# Altium schematic sheet Motor_Controller.SchDoc
size A; SheetNumber: 2; SheetTotal: 3
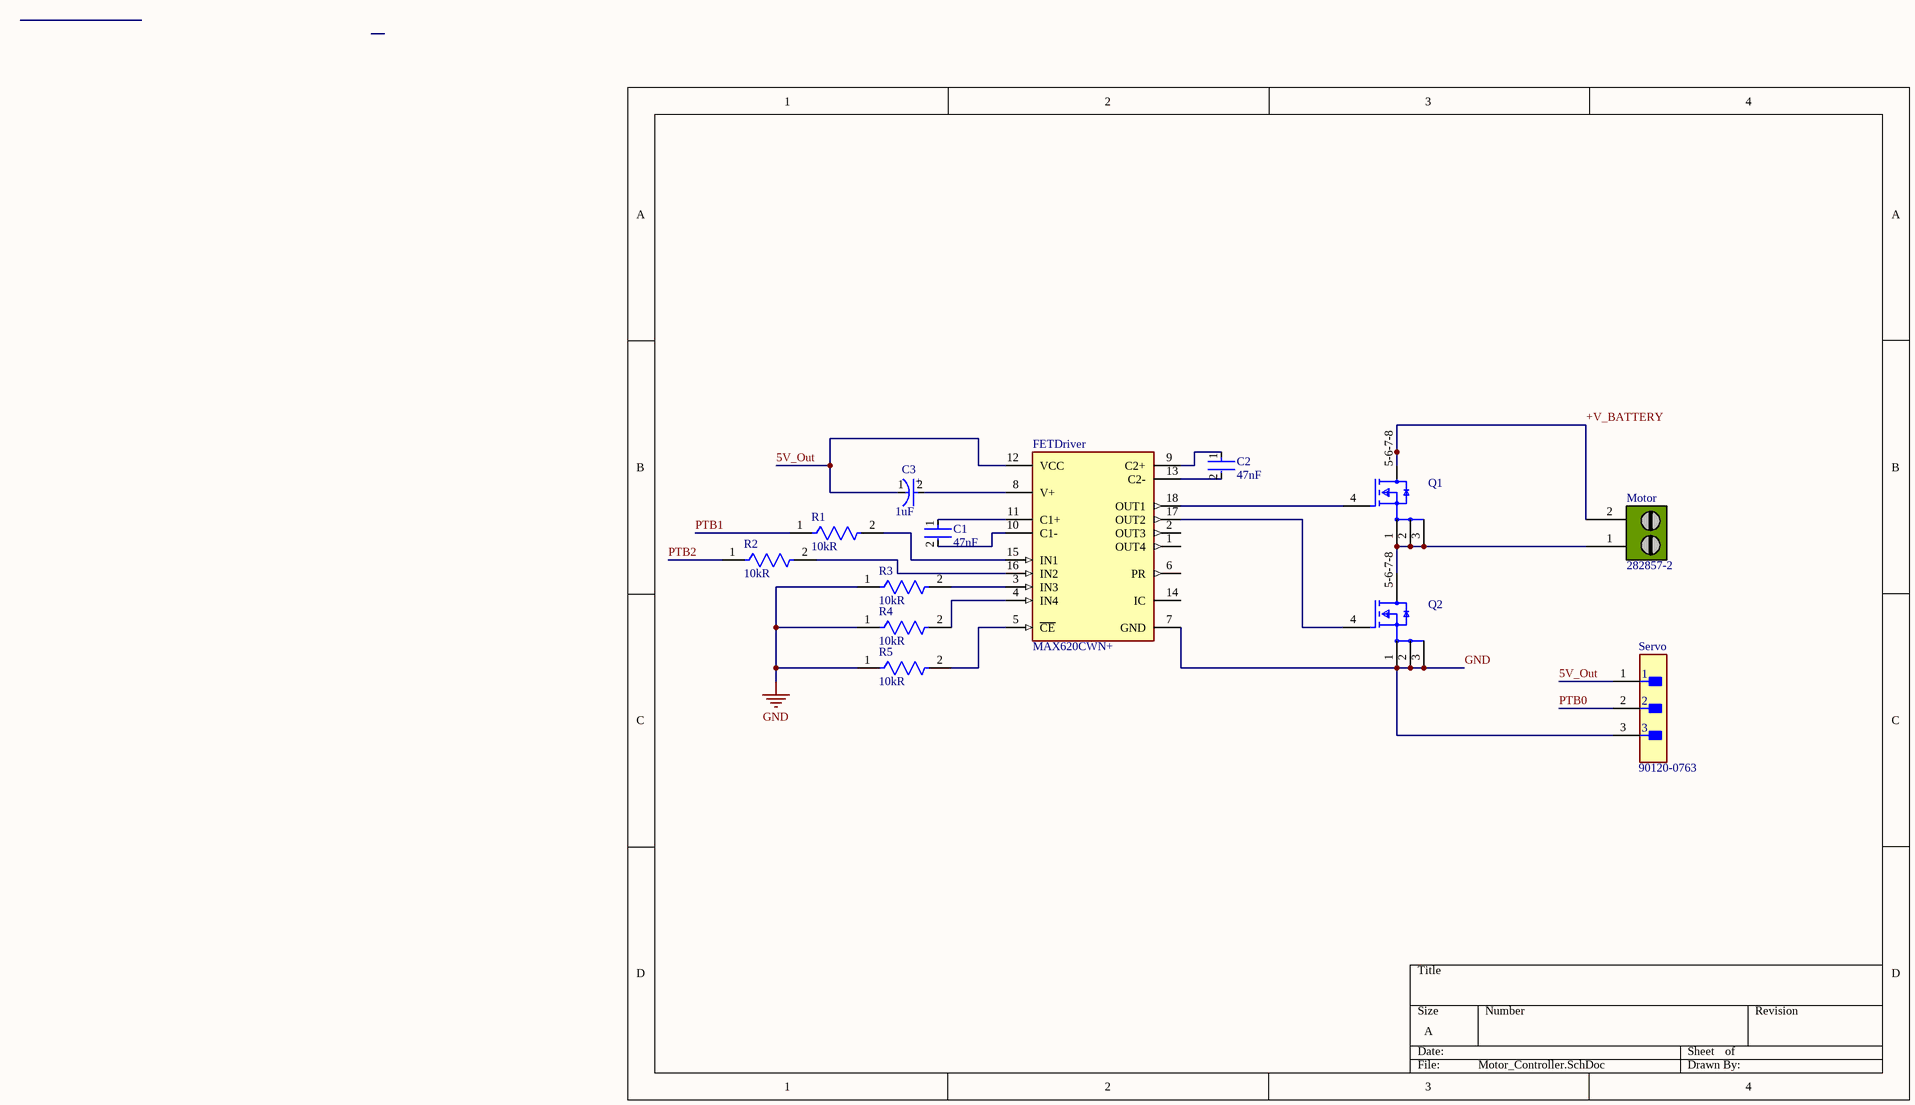
[diagram p0: Motor_Controller.SchDoc]

## Parts
C1  Capacitance: 47nF  [FP-0805-L_2_01_0_2-W_1_25-IPC_B]  (hidden comment: 08055C473JAT2A)
C2  Capacitance: 47nF  [FP-0805-L_2_01_0_2-W_1_25-IPC_B]  (hidden comment: 08055C473JAT2A)
C3  Capacitance: 1uF  [FP-T491A105K025AT-MFG]  (hidden comment: T491A105K025AT)
FETDriver  MAX620CWN+  [FP-W18-1-MFG]
Motor  282857-2  [282857-2]
Q1  CSD17306Q5A  [FP-DQJ0008A-MFG]  (value not drawn)
Q2  CSD17306Q5A  [FP-DQJ0008A-MFG]  (value not drawn)
R1  Resistance: 10kR  [FP-CR0805-IPC_B]  (hidden comment: CR0805-JW-103ELF)
R2  Resistance: 10kR  [FP-CR0805-IPC_B]  (hidden comment: CR0805-JW-103ELF)
R3  Resistance: 10kR  [FP-CR0805-IPC_B]  (hidden comment: CR0805-JW-103ELF)
R4  Resistance: 10kR  [FP-CR0805-IPC_B]  (hidden comment: CR0805-JW-103ELF)
R5  Resistance: 10kR  [FP-CR0805-IPC_B]  (hidden comment: CR0805-JW-103ELF)
Servo  90120-0763  [FP-90120-0763-MFG]

## Nets
GND: FETDriver.7(GND) Q2.1(S) Q2.2(S) Q2.3(S) R3.1 R4.1 R5.1 Servo.3
5V_Out: C3.1(C) FETDriver.12(VCC) Servo.1
+V_BATTERY: Motor.2 Q1.5-6-7-8(D)
PTB0: Servo.2
PTB1: R1.1
PTB2: R2.1
NetC1_1: C1.1 FETDriver.11(C1+)
NetC1_2: C1.2 FETDriver.10(C1-)
NetC2_1: C2.1 FETDriver.9(C2+)
NetC2_2: C2.2 FETDriver.13(C2-)
NetC3_2: C3.2(A) FETDriver.8(V+)
NetFETDriver_3: FETDriver.3(IN3) R3.2
NetFETDriver_4: FETDriver.4(IN4) R4.2
NetFETDriver_5: FETDriver.5(~{CE}) R5.2
NetFETDriver_15: FETDriver.15(IN1) R1.2
NetFETDriver_16: FETDriver.16(IN2) R2.2
NetFETDriver_17: FETDriver.17(OUT2) Q2.4(G)
NetFETDriver_18: FETDriver.18(OUT1) Q1.4(G)
NetMotor_1: Motor.1 Q1.1(S) Q1.2(S) Q1.3(S) Q2.5-6-7-8(D)

Not connected (* = marked no-connect by the designer): FETDriver 1(OUT4) 2(OUT3) 6(PR) 14(IC)

## Notes on the sheet
- (in symbol CMP-03017-000047-1) +

## Library data of the parts
C1 C2 = CMP-2007-04425-2: General Purpose Ceramic Capacitor, 0805, 47nF, 5%, X7R, 0.15, 50V; Dissipation Factor: 2.5%; Tolerance: 10%; Voltage: 50V; Voltage Rating (DC): 50V; Case Code (Imperial): 0805; Termination: SMD/SMT; Lead Free: Lead Free; Construction: Flat; Case Code (Metric): 2012; Series: -; Height: 0.94mm; Length: 2.01mm; Dielectric: X7R; Min Operating Temperature: -55°C; Voltage Rating: 50V; Max Operating Temperature: 125°C; Width: 0.049inch; Dielectric Material: Ceramic; Thickness: 0.037inch; Mount: Surface Mount; Radiation Hardening: No; REACH SVHC: No SVHC; Number of Pins: 2; Case/Package: 0805; Packaging: Tape and Reel; RoHS Compliant: Yes; Contact Plating: Tin; Depth: 1.25mm; Package Quantity: 1
C3 = CMP-03017-000047-1: CAP TANT 1UF 10% 25V 1206; Polarity: Polar; Leakage Current: 500nA; ESR (Equivalent Series Resistance): 8R; Tolerance: 20%; Dielectric Material: Tantalum; Life (Hours): 2000Hour; Dissipation Factor: 4%; Case/Package: 1206; RoHS Compliant: Yes; Voltage Rating: 25V; Voltage Rating (DC): 25V; Max Operating Temperature: 125°C; REACH SVHC: No SVHC; Lead Pitch: 1.2mm; Height - Seated (Max): 0.071inch; Packaging: Tape and Reel; Lead Free: Lead Free; Radiation Hardening: No; Width: 1.6mm; Depth: 1.6mm; Number of Pins: 2; Termination: SMD/SMT; Case Code (Metric): 3216; Features: General Purpose; Voltage: 25V; Min Operating Temperature: -55°C; Package Quantity: 1; Mount: Surface Mount; Length: 3.2mm; Height: 1.6mm; Case Code (Imperial): 1206
FETDriver = CMP-05716-000008-1: IC GATE DRVR HIGH-SIDE 18SOIC; Nominal Supply Current: 500uA; Max Power Dissipation: 762mW; Fall Time: 2500ns; Max Output Current: 25mA; Rise Time: 1700ns; Min Supply Voltage: 4.5V; Max Supply Voltage: 16.5V; Number of Outputs: 4; Max Operating Temperature: 70°C; Packaging: Rail/Tube; Mount: Surface Mount; Lead Free: Lead Free; Min Operating Temperature: 0°C; Package Quantity: 40; Radiation Hardening: No; Number of Pins: 18; Max Supply Current: 500uA; Case/Package: SOIC; Supply Current: 500uA; RoHS Compliant: Yes; Number of Drivers: 4; Series: -
Motor = 282857-2: TERM BLOCK 2POS SIDE ENT 5.08MM; Manufacturer: TE Connectivity; Number of Levels: 1; Positions Per Level: 2; Pitch: 0.200" (5.08mm); Mating Orientation: Horizontal with Board; Current: 24A; Voltage: 300V; Wire Gauge: 12-30 AWG; Wire Termination: Screw - Rising Cage Clamp; Clamp Material - Plating: Brass - Nickel Plated; Torque - Screw: 0.79 Nm (7.0 Lb-In); Screw Thread: M3; Supplier 1: Digi-Key; Supplier Part Number 1: A98359-ND; Manufacturer Part Number: 282857-2; RoHS: RoHS Compliant; Category: Connectors, Interconnects; Stock 1: 1811; Pricing 1: 1=1.19, 10=1.046, 25=0.984, 50=0.9432, 100=0.9021, 250=0.82012, 500=0.7381, 1000=0.65608, 2500=0.59457 (USD); Mounting Type: Through Hole; Features: Interlocking (Side); Color: Green; Packaging: Bulk; Operating Temperature: -; Housing Material: Polyamide (PA66), Nylon 6/6; Contact Material - Plating: Brass - Tin Plated; Screw Material - Plating: Brass - Nickel Plated; ComponentLink1URL: http://documents.tycoelectronics.com/commerce/DocumentDelivery/DDEController?Action=srchrtrv&DocNm=282857&DocType=CD&DocLang=EN; ComponentLink1Description: http://documents.tycoelectronics.com/commerce/DocumentDelivery/DDEController?Action=srchrtrv&DocNm=282857&DocType=CD&DocLang=EN; Value: 282857-2
Q1 Q2 = CMP-04962-000068-1: MOSFET N-CH 30V 24A/100A 8VSON; Element Configuration: Single; Number of Elements: 1; Turn-Off Delay Time: 18.4ns; Nominal Vgs: 1.1V; Drain to Source Resistance: 3.3mR; Rds On Max: 3.7mR; Rise Time: 13.1ns; Fall Time: 6.4ns; Turn-On Delay Time: 7.8ns; Continuous Drain Current (ID): 100A; Power Dissipation: 3.2W; Input Capacitance: 2.17nF; Gate to Source Voltage (Vgs): 10V; Polarity: N-CHANNEL; Drain to Source Breakdown Voltage: 30V; Mount: Surface Mount; Radiation Hardening: No; RoHS Compliant: Yes; Threshold Voltage: 1.1V; Contact Plating: Tin; Package Quantity: 1; Packaging: Tape and Reel; Lead Free: Contains Lead; Width: 5mm; Case/Package: SON; Max Operating Temperature: 150°C; Length: 5.8mm; Series: NexFET™; Drain to Source Voltage (Vdss): 30V; Number of Pins: 8; Min Operating Temperature: -55°C; Max Power Dissipation: 3.2W; REACH SVHC: No SVHC; Height: 1.1mm
R1-R5 = CMP-07231-003873-1: Thick Film Chip Resistors 0805 10kΩ 0.125W 5% 200ppm/°C; Power Rating: 125mW; Voltage Rating (DC): 100V; Voltage Rating: 150V; Width: 1.25mm; Composition: Thick Film; Packaging: Tape and Reel; Number of Terminations: 2; Min Operating Temperature: -55°C; Height: 0.5mm; Temperature Coefficient: 200ppm/°C; Features: Moisture Resistant; Termination: SMD/SMT; Case Code (Imperial): 0805; Package Quantity: 1; Radiation Hardening: No; Military Standard: Not; Thickness: 508um; Depth: 1.25mm; Tolerance: 5%; Contact Plating: Tin; Number of Pins: 2; Length: 2mm; Max Power Dissipation: 125mW; Mount: Surface Mount; Case Code (Metric): 2012; Case/Package: 0805; REACH SVHC: No SVHC; Max Operating Temperature: 155°C
Servo = CMP-04776-000084-1: CONN HEADER VERT 3POS 2.54MM; Manufacturer: Molex; Voltage Rating: 350V; Number Of Contacts: 3; Conn Orientation: Vertical; Current Rating: 3A; Conn Gender: Male; Package: 90120-0763; ComponentLink2Description: Datasheet; Height: 5.8mm; Manufacturer Part Number: 90120-0763; Temperature Range High: +125°C; RoHS: TRUE; ComponentLink2URL: https://www.molex.com/webdocs/datasheets/pdf/en-us/0901200763_PCB_HEADERS.pdf; Device Class L2: Headers and Wire Housings; Temperature: -55°C to +125°C; Device Class L1: Connectors; Pitch: 2.54mm; Footprint Url: https://www.molex.com/pdm_docs/sd/901200763_sd.pdf; Device Class L3: unset; Temperature Range Low: -55°C; Number Of Rows: 1; Category: Conn; Lead Free: Yes; Mouser Description: Board-To-Board Connector, C-Grid III 90120 Series, Through Hole, Header, 3, 2.54 mm; Octopart: https://octopart.com/90120-0763-molex-655433; Contact Material: Gold,Nickel; Automotive: No; Digikey Description: CONN HEADER VERT 3POS 2.54MM